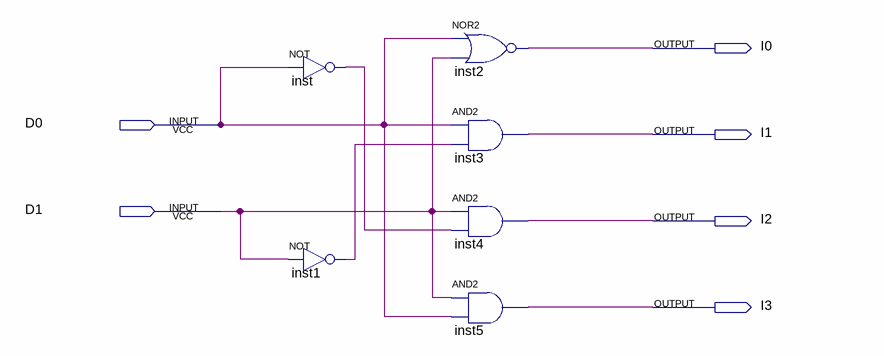
[diagram p0: schematic sheet]
// Quartus schematic decoder24.bdf as structural Verilog: 6 symbols, 6 pins
module decoder24 (
  input  D0,
  input  D1,
  output I0,
  output I1,
  output I2,
  output I3
);

  wire inst1_out, inst_out;

  not inst (inst_out, D0);
  not inst1 (inst1_out, D1);
  nor inst2 (I0, D0, D1);
  and inst3 (I1, D0, inst1_out);
  and inst4 (I2, D1, inst_out);
  and inst5 (I3, D1, D0);
endmodule
